# EAGLE design estop_tx (EAGLE 9.4.2)
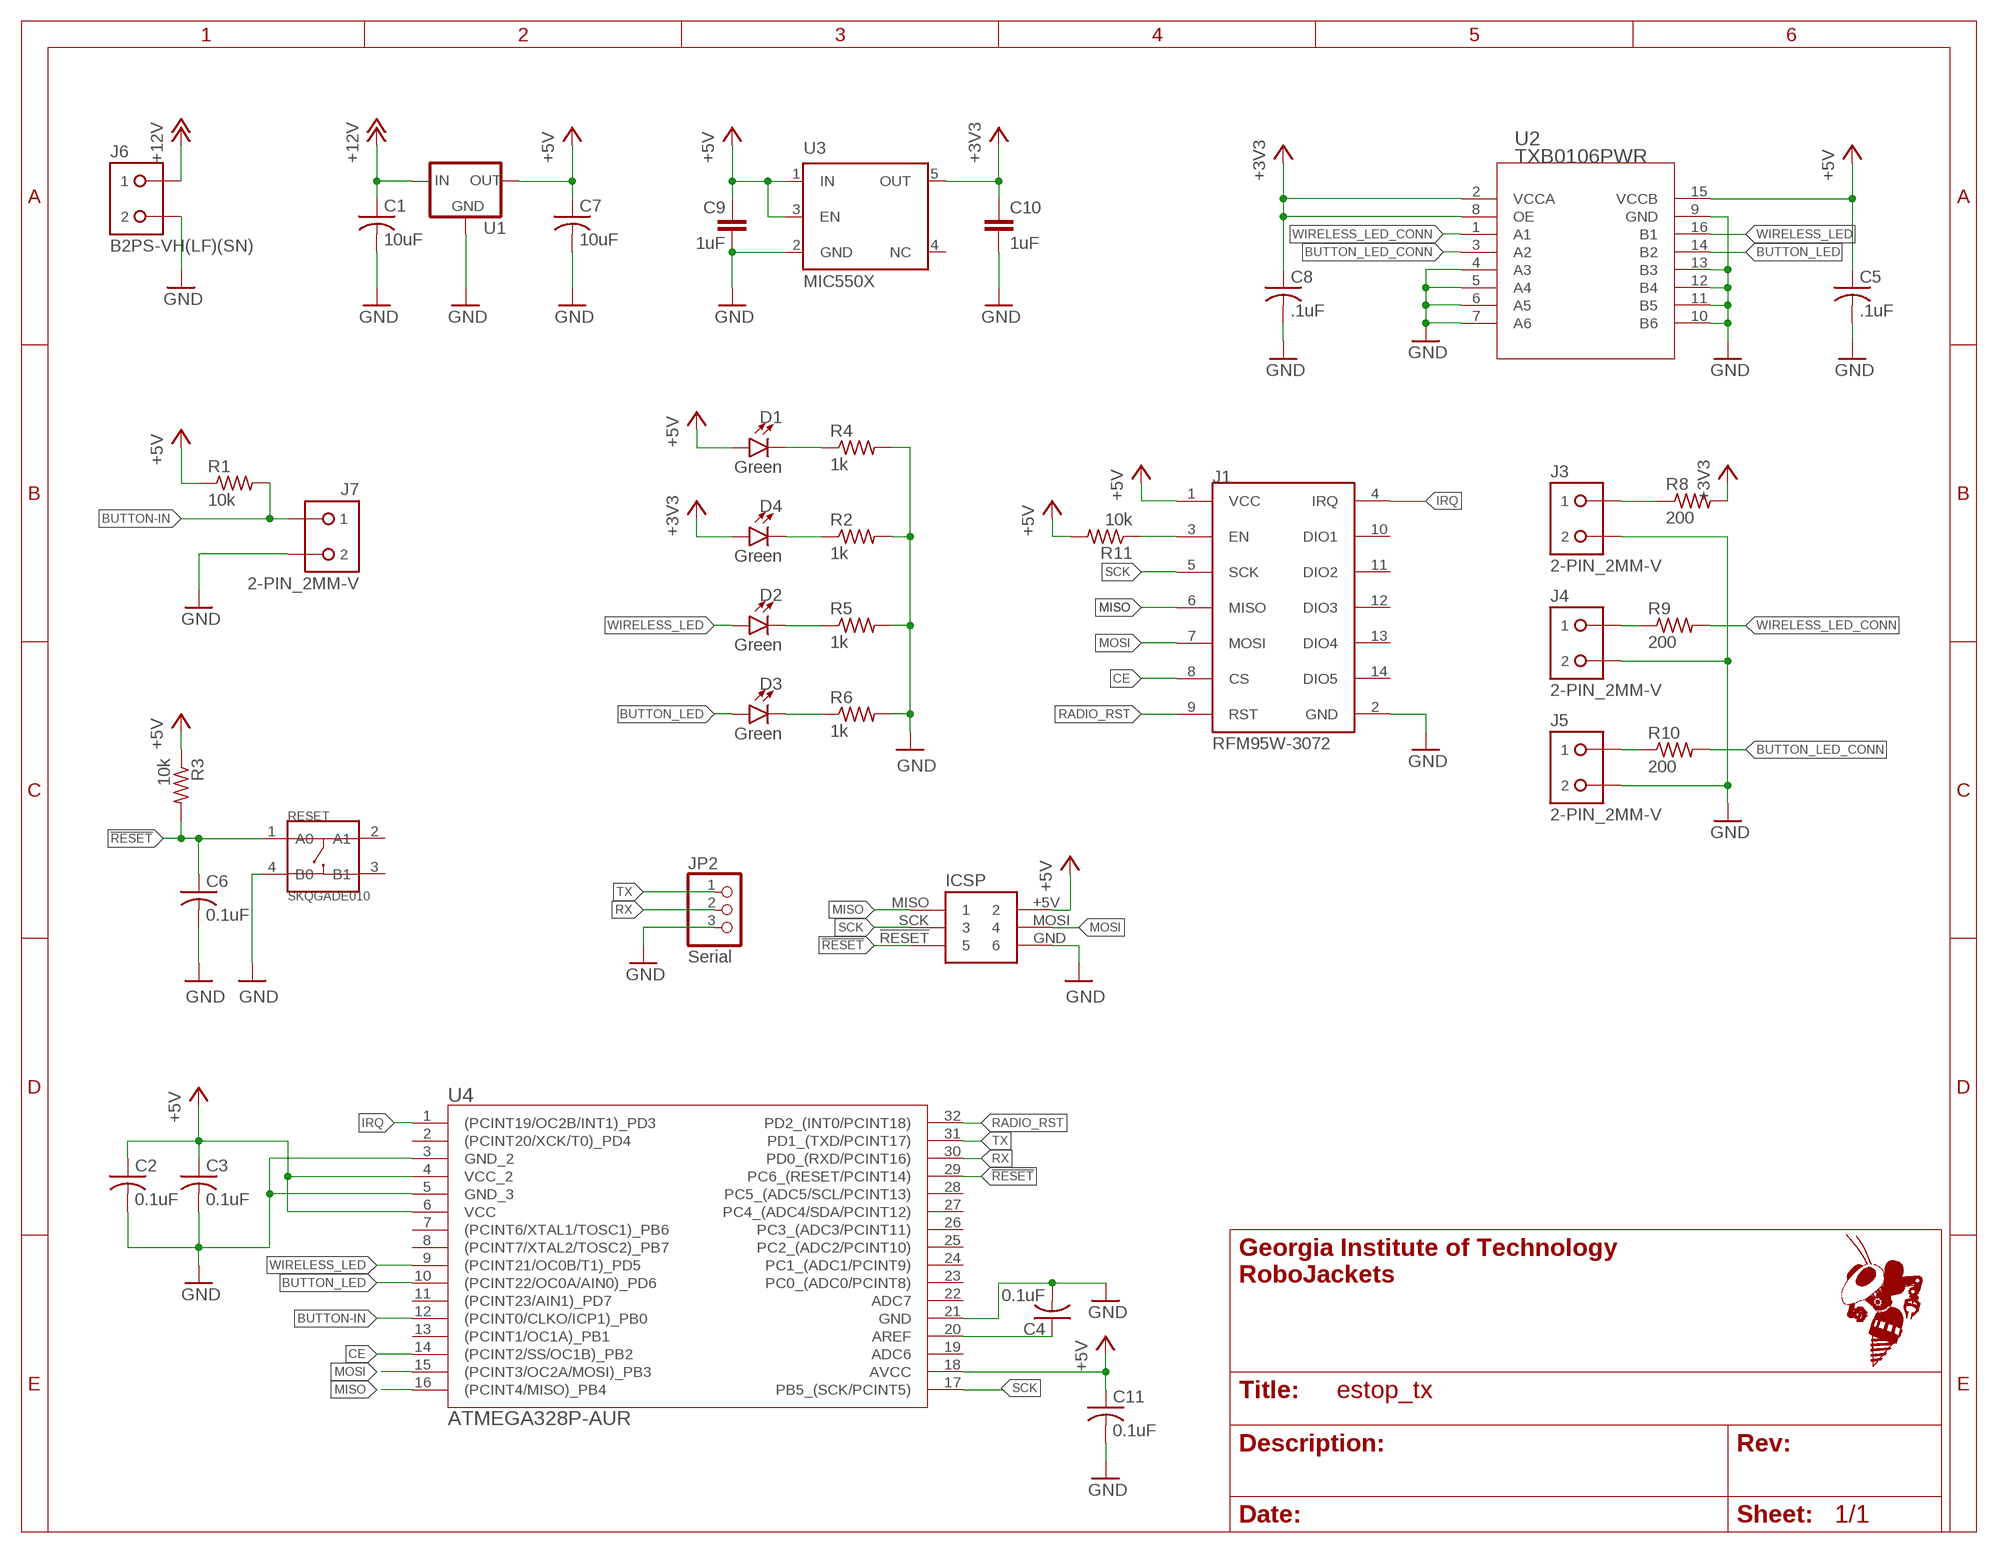
[diagram p0: schematic, sheet 1]

## Parts
C1  10uF  C-USC0805  [C0805]
C2  0.1uF  C-USC0603  [C0603]
C3  0.1uF  C-USC0603  [C0603]
C4  0.1uF  C-USC0603  [C0603]
C5  .1uF  C-USC0603  [C0603]
C6  0.1uF  C-USC0603  [C0603]
C7  10uF  C-USC0805  [C0805]
C8  .1uF  C-USC0603  [C0603]
C9  1uF  C-EUC0603  [C0603]
C10  1uF  C-EUC0603  [C0603]
C11  0.1uF  C-USC0603  [C0603]
D1  Green  LED-YELLOW0603  [LED-0603]
D2  Green  LED-YELLOW0603  [LED-0603]
D3  Green  LED-YELLOW0603  [LED-0603]
D4  Green  LED-YELLOW0603  [LED-0603]
ICSP  ICSP Connector  2X3SHROUDED  [2X3SHROUDED]
J1  RFM95W-3072  [RFM95W-3072]
J3  2-PIN_2MM-V  [2MM-2-V]
J4  2-PIN_2MM-V  [2MM-2-V]
J5  2-PIN_2MM-V  [2MM-2-V]
J6  B2PS-VH(LF)(SN)  [B2PS-CENTERED]
J7  2-PIN_2MM-V  [2MM-2-V]
JP2  Serial  PINHD-1X3  [1X03]
R1  10k  R-US_R0603  [R0603]
R2  1k  R-US_R0603  [R0603]
R3  10k  R-US_R0603  [R0603]
R4  1k  R-US_R0603  [R0603]
R5  1k  R-US_R0603  [R0603]
R6  1k  R-US_R0603  [R0603]
R8  200  R-US_R0603  [R0603]
R9  200  R-US_R0603  [R0603]
R10  200  R-US_R0603  [R0603]
R11  10k  R-US_R0603  [R0603]
RESET  SKQGADE010  SMD-SWITCH-TOP-260GF(4P-D5.2MM)  [SW4-SMD-5.2X5.2X1.5MM]
U1  R-78E5.0-1.0CONV_R-78E5.0-1.0  [CONV_R-78E5.0-1.0]
U2  TXB0106PWR  [PW16]
U3  MIC550X  [SOT23-DBV]
U4  ATMEGA328P-AUR  [ATMEGA328P-AUR]

## Nets
!RESET: C6.1 ICSP.!RESET R3.2 RESET.1(A0) U4.29(PC6_(RESET/PCINT14))
+3V3: C8.1 C10.1 D4.A R8.2 U2.2(VCCA) U2.8(OE) U3.5(OUT)
+5V: C2.1 C3.1 C5.1 C7.1 C9.1 C11.1 D1.A ICSP.+5V J1.1(VCC) R1.1 R3.1 R11.2 U1.3(OUT) U2.15(VCCB) U3.1(IN) U3.3(EN) U4.4(VCC_2) U4.6(VCC) U4.18(AVCC)
+12V: C1.1 J6.1 U1.1(IN)
BUTTON-IN: J7.1 R1.2 U4.12((PCINT0/CLKO/ICP1)_PB0)
BUTTON_LED: D3.A U2.14(B2) U4.10((PCINT22/OC0A/AIN0)_PD6)
BUTTON_LED_CONN: R10.2 U2.3(A2)
CE: J1.8(CS) U4.14((PCINT2/SS/OC1B)_PB2)
EN: J1.3(EN) R11.1
GND: C1.2 C2.2 C3.2 C4.2 C5.2 C6.2 C7.2 C8.2 C9.2 C10.2 C11.2 ICSP.GND J1.2(GND) J3.2 J4.2 J5.2 J6.2 J7.2 JP2.3 R2.2 R4.2 R5.2 R6.2 RESET.4(B0) U1.2(GND) U2.4(A3) U2.5(A4) U2.6(A5) U2.7(A6) U2.9(GND) U2.10(B6) U2.11(B5) U2.12(B4) U2.13(B3) U3.2(GND) U4.3(GND_2) U4.5(GND_3) U4.21(GND)
IRQ: J1.4(IRQ) U4.1((PCINT19/OC2B/INT1)_PD3)
MISO: ICSP.MISO J1.6(MISO) U4.16((PCINT4/MISO)_PB4)
MOSI: ICSP.MOSI J1.7(MOSI) U4.15((PCINT3/OC2A/MOSI)_PB3)
N$1: J3.1 R8.1
N$2: D1.C R4.1
N$3: D3.C R6.1
N$4: D2.C R5.1
N$5: D4.C R2.1
N$7: J4.1 R9.1
N$8: J5.1 R10.1
N$9: C4.1 U4.20(AREF)
RADIO_RST: J1.9(RST) U4.32(PD2_(INT0/PCINT18))
RX: JP2.2 U4.30(PD0_(RXD/PCINT16))
SCK: ICSP.SCK J1.5(SCK) U4.17(PB5_(SCK/PCINT5))
TX: JP2.1 U4.31(PD1_(TXD/PCINT17))
WIRELESS_LED: D2.A U2.16(B1) U4.9((PCINT21/OC0B/T1)_PD5)
WIRELESS_LED_CONN: R9.2 U2.1(A1)
Unconnected: J1.10(DIO1) J1.11(DIO2) J1.12(DIO3) J1.13(DIO4) J1.14(DIO5) RESET.2(A1) RESET.3(B1) U3.4(NC) U4.2((PCINT20/XCK/T0)_PD4) U4.7((PCINT6/XTAL1/TOSC1)_PB6) U4.8((PCINT7/XTAL2/TOSC2)_PB7) U4.11((PCINT23/AIN1)_PD7) U4.13((PCINT1/OC1A)_PB1) U4.19(ADC6) U4.22(ADC7) U4.23(PC0_(ADC0/PCINT8)) U4.24(PC1_(ADC1/PCINT9)) U4.25(PC2_(ADC2/PCINT10)) U4.26(PC3_(ADC3/PCINT11)) U4.27(PC4_(ADC4/SDA/PCINT12)) U4.28(PC5_(ADC5/SCL/PCINT13))

## Library data of the parts
C1-C8 C11 = rcl:C-US: CAPACITOR, American symbol; SPICEPREFIX: C
C9 C10 = rcl:C-EU: CAPACITOR, European symbol; SPICEPREFIX: C
D1-D4 = SparkFun-LED:LED-YELLOW: Yellow SMD LED Used in manufacturing several products at SparkFun. Packages: 0603 - SMD 0603 package[Product Link] <http://www.kingbrightusa.com/product.asp?catalog_name=LED&product_id=APT1608SYCK> 0603 -SMART - SMART SMD 0603 package (more efficient/more expensive) [Product Link] <http://www.osram-os.com/osram_os/en/products/product-catalog/led-light-emitting-diodes/smartled-0603/ly-l29k/index.jsp> LilyPad - SMD1206 package[Product Datasheet] <https://www.sparkfun.com/datasheets/DevTools/LilyPad/Q150YUS4.pdf> SparkFun Products: Blynk Board <https://www.sparkfun.com/products/13794> IOIO-OTG <https://www.sparkfun.com/products/13613> XBee Explorer Serial <https://www.sparkfun.com/products/13225>; PROD_ID: DIO-09003; VALUE: Yellow
ICSP = lcd-buzzer:2X3SHROUDED
J1 = IGVC-Connector:RFM95W-3072: Adafruit Breakout Board for RFM95W Radio Module
J3-J5 J7 = RoboJackets-Connectors:2-PIN_2MM-*; PINS: 2; PIN_PITCH: 2.0 mm
J6 = RoboJackets-Connectors:B2P?-VH(LF)(SN): Power Connector Brand: JST Sales America Inc. <https://www.jst.com/> Series: VH <http://www.digikey.com/product-search/en?FV=fff40016,fff802f3,ffec0e9d> Distributor: Digi-Key <http://www.digikey.com/product-detail/en/B2PS-VH%28LF%29%28SN%29/455-1648-ND/926555>; DIGIKEY: 455-1648-ND; MPN: B2PS-VH(LF)(SN)
JP2 = pinhead:PINHD-1X3: PIN HEADER
R1 = resistor:R-US_: RESISTOR, American symbol
R2-R6 R8-R11 = rcl:R-US_: RESISTOR, American symbol; SPICEPREFIX: R
RESET = rgb-led:SMD-SWITCH-TOP-260GF(4P-D5.2MM): 311020017; MPN: SKQGADE010
U1 = IGVC-Regulator:R-78E5.0-1.0: Recom Power 5V 1A DC/DC Converter The Recom R-78E5.0-X.X is a compact DC/DC converter module that is a pin for pin drop-in replacement for the LM7805 linear voltage regulator. Specifications: Input Range: 7-28V Output Voltage: 5V Output Current: 1A Max Efficiency: 91% Datasheet <https://www.recom-power.com/pdf/Innoline/R-78Exx-1.0.pdf>
U2 = IGVC-IC:TXB0106PWR; MANUFACTURER_PART_NUMBER: TXB0106PWR; VENDOR: Texas Instruments
U3 = IGVC-Regulator:MIC550X
U4 = lcd-buzzer:ATMEGA328P-*

## Net classes
1 power: width 0.3 mm

## Board
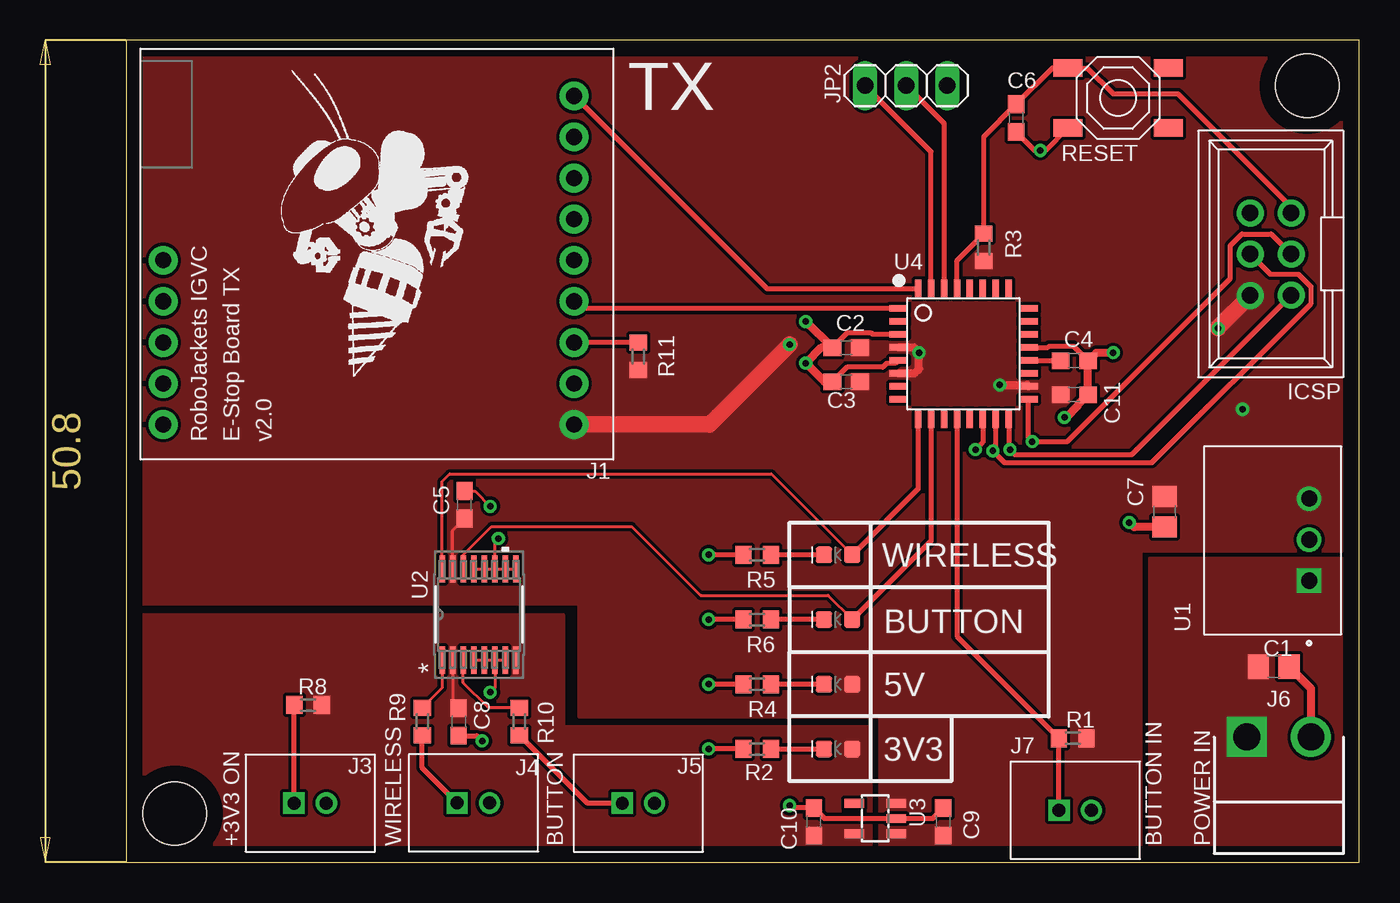
[diagram p1: board, top side]
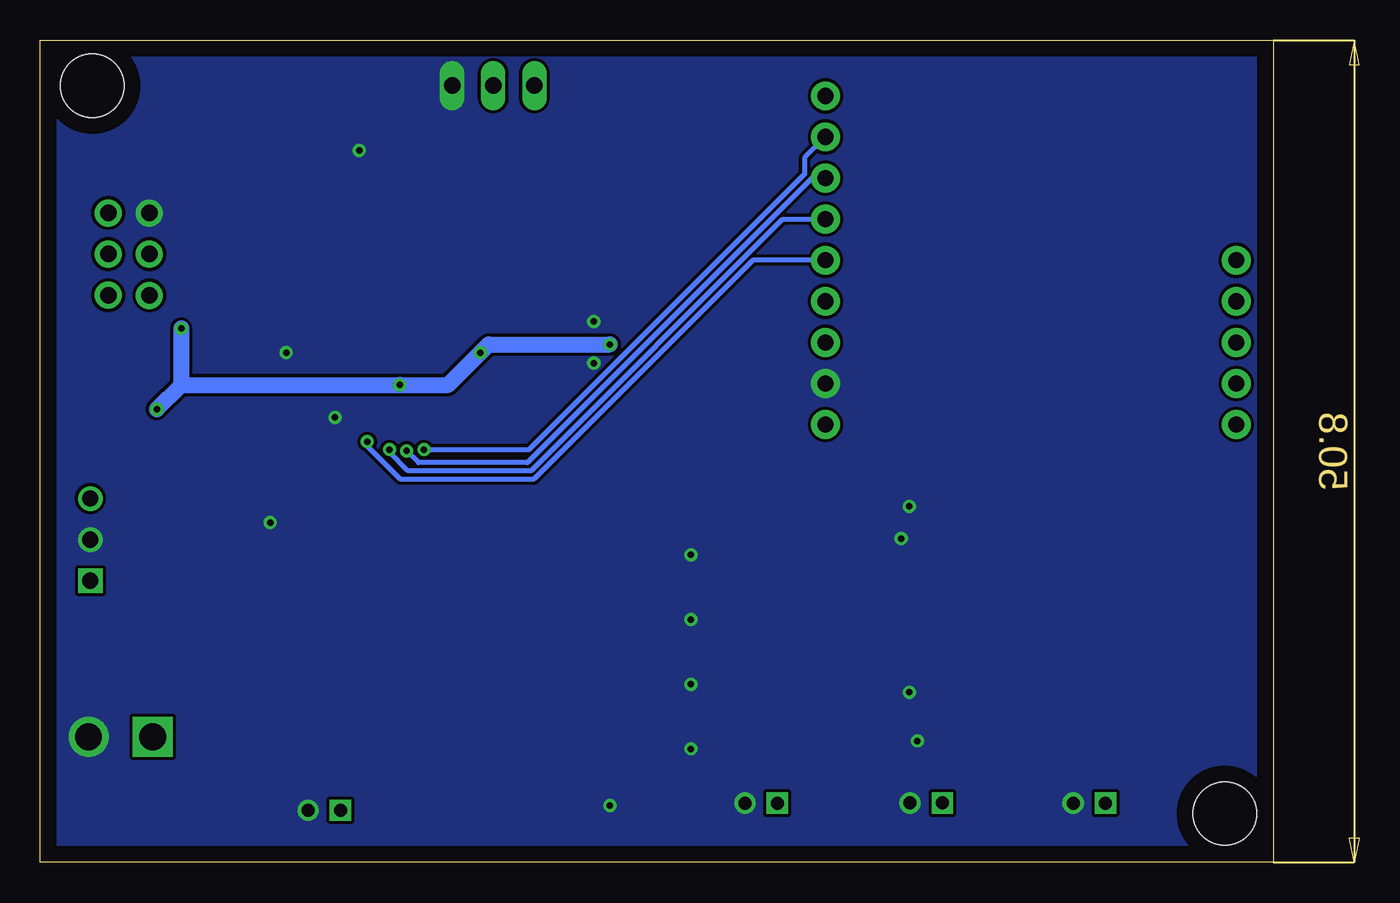
[diagram p2: board, bottom side, seen from below]

Size 76.2 x 50.8 mm. Coordinates in mm from the lower left corner, seen from the top.
Outline: 0,0 76.2,0 76.2,50.8 0,50.8 0,0
Copper layers (1*16): Top 0.035mm / dielectric 1.5mm / Bottom 0.035mm
Design rules "default *": minimum track width 0.2mm, minimum drill 0.4mm, track to track 0.2mm, track to pad 0.25mm, pad to pad 0.2mm, via to via 0.25mm, smd to smd 0.2mm, copper to edge 1mm, drill to drill 0.2mm, minimum pad ring 10mil, minimum via ring 8mil, stop-mask expansion 4mil, vias tented up to drill 16mil, thermal gap 10mil

### Footprints (pad centres in the part's own frame; a part is rotated, then mirrored left to right if it is on the bottom)
C0805 = smd 1.3 x 1.5: 1 -0.95,0; 2 0.95,0
C0603 = smd 1.1 x 1: 1 -0.85,0; 2 0.85,0
LED-0603 = smd 1 x 1: A -0.877,0; C 0.877,0
2X3SHROUDED = drill 1.02 pad 1.676: !RESET -2.54,1.27; +5V 2.554,-1.27; GND -2.54,-1.27; MISO 2.54,1.27; MOSI 0,-1.27; SCK 0,1.27
RFM95W-3072 = drill 1 pad 1.778: 1 -10.541,-12.192; 2 -8.001,-12.192; 3 -5.461,-12.192; 4 -2.921,-12.192; 5 -0.381,-12.192; 6 2.159,-12.192; 7 4.699,-12.192; 8 7.239,-12.192; 9 9.779,-12.192; 10 -10.541,13.208; 11 -8.001,13.208; 12 -5.461,13.208; 13 -2.921,13.208; 14 -0.381,13.208
2MM-2-V = drill 0.8 square: 1 -1,0 | drill 0.8: 2 1,0
B2PS-CENTERED = drill 1.65 square: 1 -1.98,0 | drill 1.65: 2 1.98,0
1X03 = drill 1.016 long: 1 -2.54,0; 2 0,0; 3 2.54,0
R0603 = smd 1 x 1.1: 1 -0.85,0; 2 0.85,0
SW4-SMD-5.2X5.2X1.5MM = smd 1.8 x 1.1: 1 -3.1,1.85; 2 3.1,1.85; 3 3.1,-1.85; 4 -3.1,-1.85
CONV_R-78E5.0-1.0 = drill 1 square: 1 -2.54,-2.25 | drill 1: 2 0,-2.25; 3 2.54,-2.25
PW16 = smd 1.676 x 0.356: 1 -2.819,2.275; 2 -2.819,1.625; 3 -2.819,0.975; 4 -2.819,0.325; 5 -2.819,-0.325; 6 -2.819,-0.975; 7 -2.819,-1.625; 8 -2.819,-2.275; 9 2.819,-2.275; 10 2.819,-1.625; 11 2.819,-0.975; 12 2.819,-0.325; 13 2.819,0.325; 14 2.819,0.975; 15 2.819,1.625; 16 2.819,2.275
SOT23-DBV = smd 0.55 x 1.2: 1 -0.95,-1.3; 2 0,-1.3; 3 0.95,-1.3; 4 0.95,1.3; 5 -0.95,1.3
ATMEGA328P-AUR = smd 1.15 x 0.4: 1 -3.946,2.603; 2 -3.955,1.803; 3 -3.955,1.003; 4 -3.955,0.203; 5 -3.955,-0.597; 6 -3.955,-1.397; 7 -3.955,-2.197; 8 -3.955,-2.997; 17 4.085,-2.997; 18 4.085,-2.197; 19 4.085,-1.397; 20 4.085,-0.597; 21 4.085,0.203; 22 4.085,1.003; 23 4.085,1.803; 24 4.085,2.603 | smd 0.4 x 1.15: 9 -2.743,-4.21; 10 -1.943,-4.21; 11 -1.143,-4.207; 12 -0.343,-4.21; 13 0.457,-4.21; 14 1.257,-4.207; 15 2.057,-4.207; 16 2.857,-4.207; 25 2.857,3.813; 26 2.057,3.813; 27 1.257,3.813; 28 0.457,3.811; 29 -0.343,3.811; 30 -1.143,3.813; 31 -1.943,3.811; 32 -2.743,3.811
STANDOFF-HOLE = hole 3.9: 0,0

### Placement (x,y rotation side)
C1  70.92,12.1 0 top
C2  44.5,31.8 180 top
C3  44.5,29.7 180 top
C4  58.6,31 0 top
C5  20.91,22.1 90 top
C6  55,46 270 top
C7  64.19,21.66 270 top
C8  20.55,8.68 270 top
C9  50.5,2.5 90 top
C10  42.5,2.5 90 top
C11  58.6,28.9 0 top
D1  44,11 180 top
D2  44,19 180 top
D3  44,15 180 top
D4  44,7 180 top
ICSP  70.74,37.59 270 top
J1  15.49,37.59 90 top
J3  11.37,3.65 0 top
J4  21.46,3.66 0 top
J5  31.66,3.65 0 top
J6  71.25,7.75 0 top
J7  58.66,3.21 0 top
JP2  48.21,48.01 0 top
R1  58.5,7.66 180 top
R2  39,7 180 top
R3  53,38 90 top
R4  39,11 180 top
R5  39,19 180 top
R6  39,15 180 top
R8  11.25,9.72 0 top
R9  18.3,8.7 90 top
R10  24.3,8.7 90 top
R11  31.65,31.27 270 top
RESET  61.31,47.24 0 top
U1  70.87,19.94 90 top
U2  21.81,15.31 90 top
U3  46.3,2.7 90 top
U4  51.69,31.62 0 top
U$1  [ROBOBUZZ_1.0X]  14,30 0 top
U$2  [STANDOFF-HOLE]  3,3 0 top
U$3  [STANDOFF-HOLE]  73,48 0 top

### Tracks (layer width: path | path; a pad name or v marks a point on that pad's centre or on a via)
!RESET
  Top 0.3: U4.29 51.35,37.2 R3.2 53,44.85 C6.1 57.24,49.09 RESET.1 59.41,49.09 61,47.5 65,47.5 72.01,40.49 ICSP.!RESET
+3V3
  Top 0.2: U2.2 20.18,9.89 C8.1
  pour Top (no thermals): 0.21,15.3 27,15.3 27,8.36 45.99,8.36 45.99,0.13 0.21,0.13
+5V  (via drill 0.4)
  Top 0.2: U2.15 20.18,20.52 C5.1
  Top 0.5: v54,29.5 55.7,29.5 U4.18 | U4.4 48.67,31.83 v49,31.5 49,30.5 48.73,30.23 U4.6
  Top 1: ICSP.+5V 67.5,33.07 v67.5,33 | v41,32 36.05,27.05 J1.1
  Bottom 1: v67.5,33 67.5,29.5 | 67.5,29.5 v69,28 | v41,32 48.5,32 v49,31.5 51,29.5 v54,29.5 67.5,29.5
  pour Top (no thermals): 0.27,50.65 0.27,16 28,16 28,9 46.6,9 46.6,0.13 62.7,0.13 62.7,19.27 76,19.27 76,50.65
+12V
  pour Top (no thermals): 75.95,18.8 63.25,18.8 63.25,0.13 75.95,0.13
BUTTON-IN
  Top 0.3: U4.12 51.35,13.96 R1.2 J7.1
BUTTON_LED
  Top 0.2: U2.14 20.84,18.99 22.6,20.75 31.25,20.75 35.5,16.5 43.38,16.5 D3.A
  Top 0.3: U4.10 49.75,19.87 D3.A
BUTTON_LED_CONN
  Top 0.2: R10.2 22.39,9.55 20.84,11.1 U2.3
CE  (via drill 0.4)
  Top 0.3: U4.14 52.95,25.95 v52.5,25.5
  Bottom 0.3: v52.5,25.5 46,25.5 28.98,42.52 28.98,43.54 J1.8
EN
  Top 0.3: R11.1 J1.3
GND  (via drill 0.4)
  Top 0.2: C5.2 21.55,22.95 v22.5,22 | U2.4 U2.5 U2.6 | U2.6 U2.7 | U2.6 22.79,10.79 v22.5,10.5 | U2.13 U2.12 U2.11 | U2.11 U2.10 U2.9 | U2.11 22.79,19.79 v23,20
  Top 0.3: R5.2 v36,19 | R6.2 v36,15 | R2.2 v36,7 | R4.2 v36,11 | C9.2 49.85,2.7 U3.2 43.15,2.7 C10.2 41.15,3.35 v41,3.5 | C8.2 21.68,7.83 v22,7.5 | RESET.4 56.81,44 v56.5,44 56.15,44 C6.2 | U4.21 56.96,31.83 57.03,31.9 58.55,31.9 C4.2 | U4.5 47.53,30.83 46.99,30.83 46.77,30.6 44.55,30.6 C3.2 | U4.3 46.14,32.63 46.07,32.7 44.55,32.7 C2.2
  Top 0.5: C7.2 62.29,20.71 v62,21 | v58,27.5 58.11,27.5 58.8,28.19 58.8,28.25 C11.2 C4.2 59.95,31.5 v61,31.5 | C3.2 43.15,29.7 v42,30.85 42.95,31.8 C2.2 42.03,33.42 v42,33.42 | C1.2 73.23,10.74 J6.2
  pour Bottom (no thermals): 0.25,50.67 0.25,0.13 75.95,0.13 75.95,50.67
IRQ
  Top 0.3: U4.1 28.13,34.23 J1.4
MISO  (via drill 0.4)
  Top 0.3: U4.16 54.55,25.58 v54.62,25.5 54.93,25.2 62.15,25.2 ICSP.MISO
  Bottom 0.3: J1.6 30.34,39.75 45.89,24.2 53.47,24.2 54.62,25.35 v54.62,25.5
MOSI  (via drill 0.4)
  Top 0.3: U4.15 53.75,25.61 v53.57,25.43 53.82,25.18 53.82,25.17 54.29,24.7 63.41,24.7 73.25,34.54 73.25,35.56 72.46,36.35 70.71,36.35 ICSP.MOSI
  Bottom 0.3: J1.7 28.5,42.29 46.1,24.7 52.83,24.7 v53.57,25.43
N$1
  Top 0.3: J3.1 10.37,9.69 R8.1
N$2
  Top 0.3: D1.C R4.1
N$3
  Top 0.3: D3.C R6.1
N$4
  Top 0.3: D2.C R5.1
N$5
  Top 0.3: R2.1 D4.C
N$7
  Top 0.3: J4.1 18.3,5.82 R9.1
N$8
  Top 0.3: J5.1 28.5,3.65 R10.1
N$9
  Top 0.3: U4.20 55.8,31 C4.1
RADIO_RST
  Top 0.3: U4.32 39.62,35.43 J1.9
RX
  Top 0.3: JP2.2 50.55,45.67 U4.30
SCK  (via drill 0.4)
  Top 0.3: U4.17 55.77,26.23 v56,26 58.17,26 68.23,36.06 68.23,38.1 68.96,38.83 70.77,38.83 ICSP.SCK
  Bottom 0.3: J1.5 32.17,37.21 45.68,23.7 53.96,23.7 56,25.74 v56,26
TX
  Top 0.3: U4.31 49.75,43.93 JP2.1
WIRELESS_LED
  Top 0.2: U2.16 19.54,23.54 20,24 39.88,24 D2.A
  Top 0.3: U4.9 48.95,23.07 D2.A
WIRELESS_LED_CONN
  Top 0.2: U2.1 19.54,10.79 R9.2

### Text on the board
tPlace: TX | ICSP | RoboJackets IGVC | E-Stop Board TX | v2.0 | WIRELESS | BUTTON | 5V | 3V3 | +3V3 ON | WIRELESS | BUTTON | BUTTON IN | POWER IN
tValues: IGVC E-Stop Board / v1.1